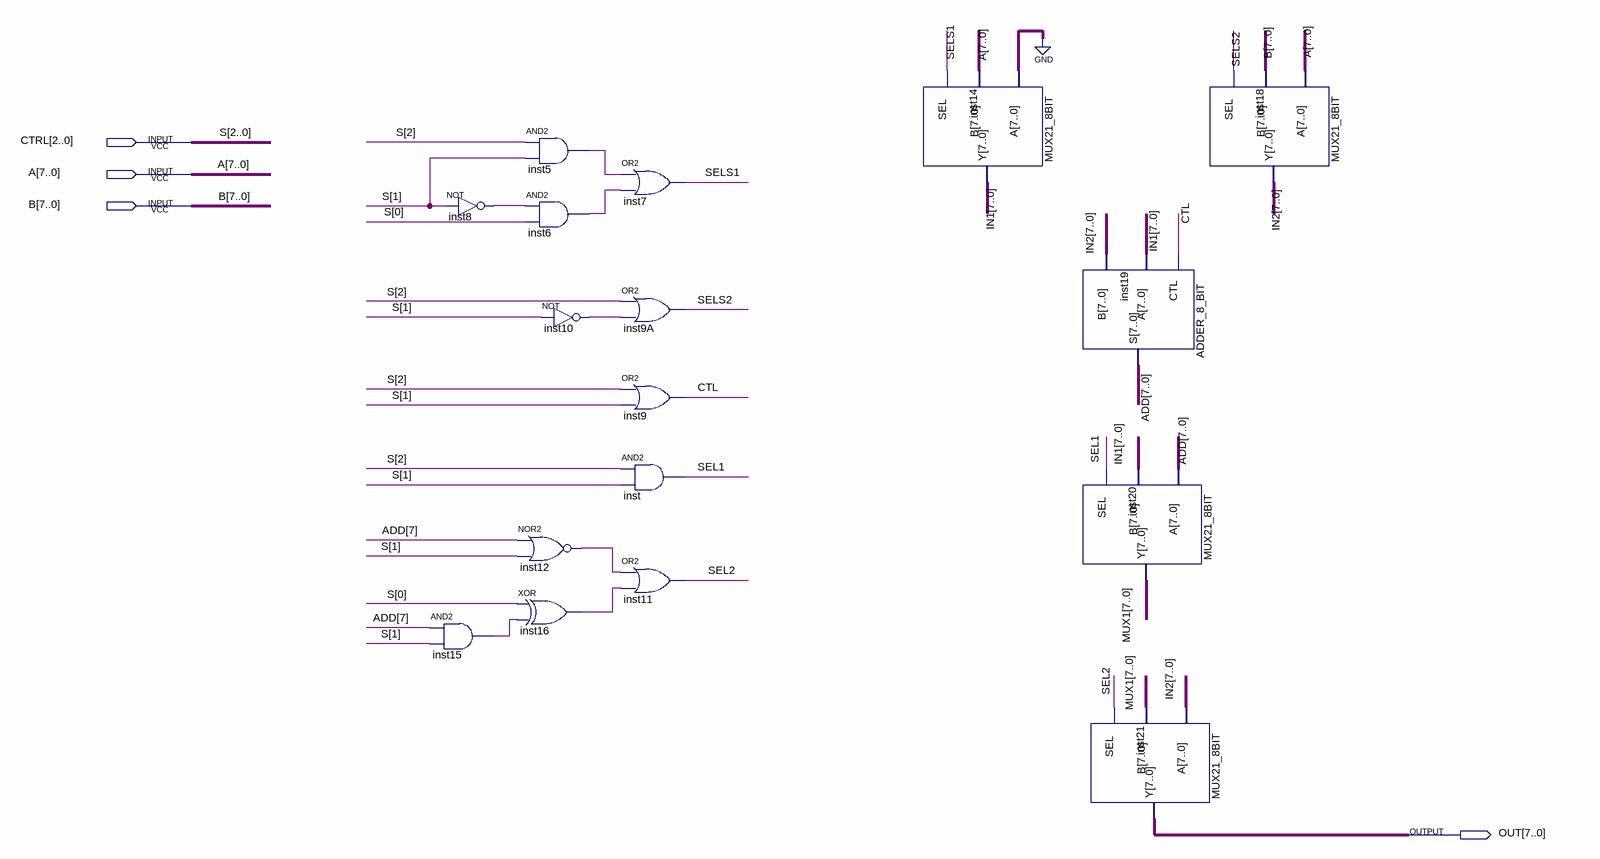
[diagram p0: schematic sheet]
// Quartus schematic AU.bdf as structural Verilog: 17 symbols, 4 pins
module AU (
  input  [2:0] CTRL,
  input  [7:0] A,
  input  [7:0] B,
  output [7:0] OUT
);

  wire CTL, inst5_out, inst6_out, inst8_out, inst10_out, inst12_out, inst15_out, inst16_out, SEL1, SEL2,
       SELS1, SELS2;
  wire [7:0] ADD, IN1, IN2, MUX1;

  not inst8 (inst8_out, CTRL[1]);
  and inst15 (inst15_out, ADD[7], CTRL[1]);
  and inst5 (inst5_out, CTRL[2], CTRL[1]);
  and inst6 (inst6_out, inst8_out, CTRL[0]);
  not inst10 (inst10_out, CTRL[1]);
  nor inst12 (inst12_out, ADD[7], CTRL[1]);
  xor inst16 (inst16_out, CTRL[0], inst15_out);
  or inst7 (SELS1, inst5_out, inst6_out);
  or inst9A (SELS2, CTRL[2], inst10_out);
  or inst9 (CTL, CTRL[2], CTRL[1]);
  and inst (SEL1, CTRL[2], CTRL[1]);
  or inst11 (SEL2, inst12_out, inst16_out);
  MUX21_8BIT inst14 (.A({8{1'b0}}), .B(A), .SEL(SELS1), .Y(IN1));
  ADDER_8_BIT inst19 (.CTL(CTL), .A(IN1), .B(IN2), .S(ADD));
  MUX21_8BIT inst20 (.A(ADD), .B(IN1), .SEL(SEL1), .Y(MUX1));
  MUX21_8BIT inst21 (.A(IN2), .B(MUX1), .SEL(SEL2), .Y(OUT));
  MUX21_8BIT inst18 (.A(A), .B(B), .SEL(SELS2), .Y(IN2));

  // Other names for the same wires on the sheet: S[2:0] = CTRL
endmodule
